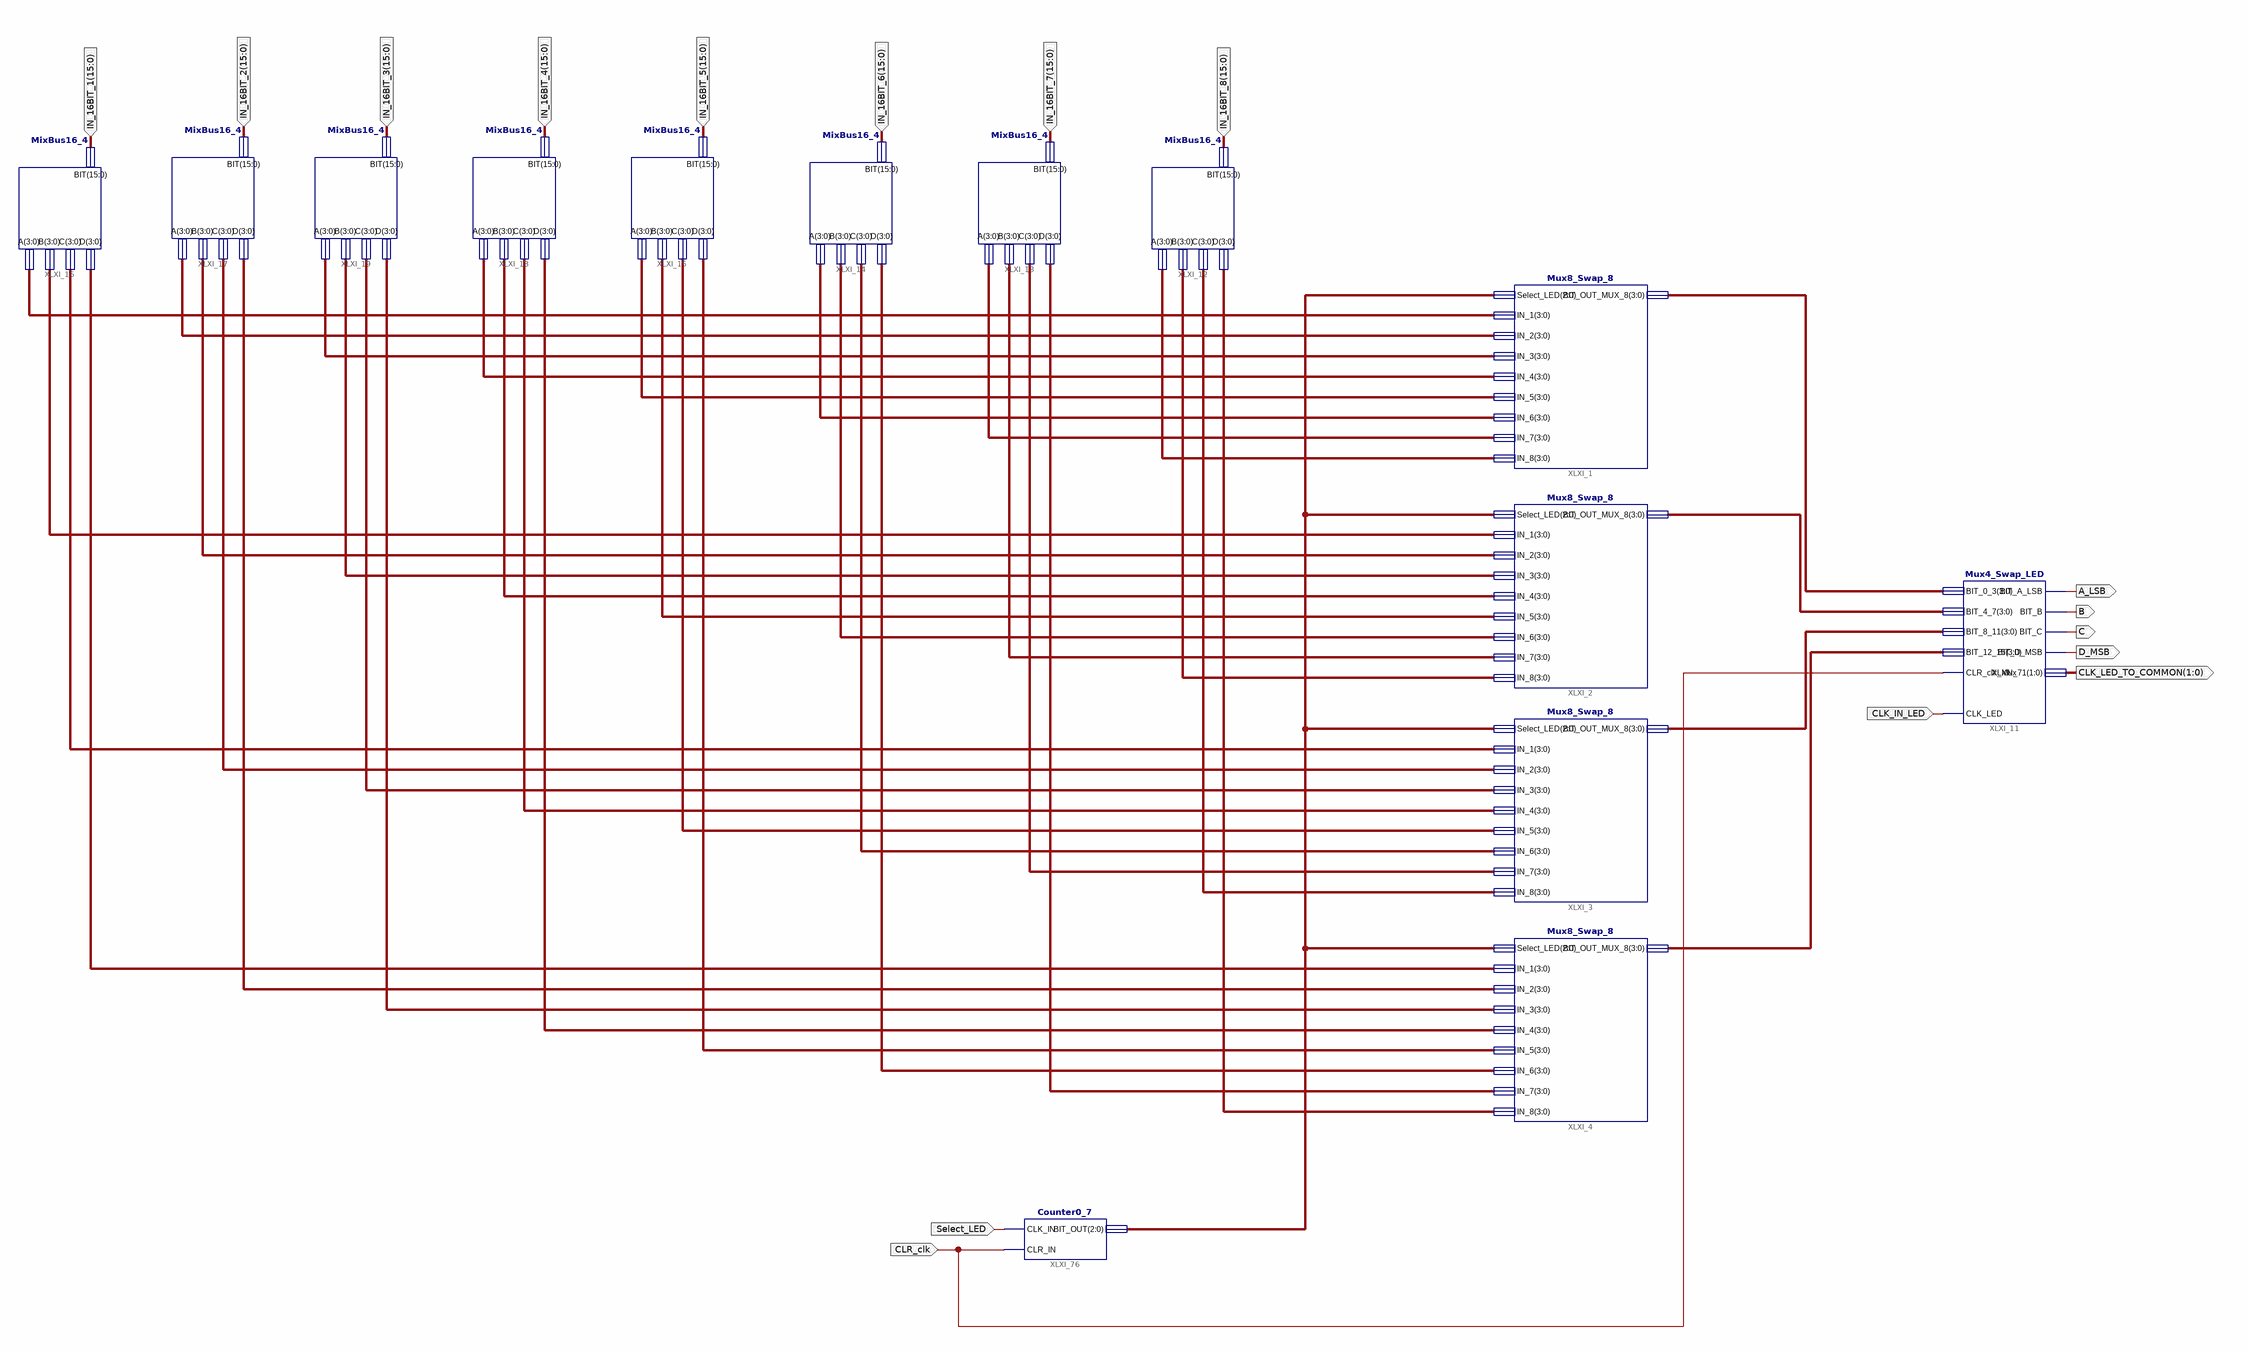
[diagram p0: schematic sheet 1]
// Xilinx ISE schematic Mux_8_Swap_1.sch (spartan6) as structural Verilog: 14 symbols, 16 ports
module Mux_8_Swap_1 (
  input  [15:0] IN_16BIT_1,
  input  [15:0] IN_16BIT_2,
  input  [15:0] IN_16BIT_3,
  input  [15:0] IN_16BIT_4,
  input  [15:0] IN_16BIT_5,
  input  [15:0] IN_16BIT_6,
  input  [15:0] IN_16BIT_7,
  input  [15:0] IN_16BIT_8,
  input  CLR_clk,
  input  Select_LED,
  input  CLK_IN_LED,
  output A_LSB,
  output B,
  output C,
  output D_MSB,
  output [1:0] CLK_LED_TO_COMMON
);

  wire [2:0] XLXN_8;
  wire [3:0] XLXN_1, XLXN_2, XLXN_3, XLXN_4, XLXN_67, XLXN_68, XLXN_69, XLXN_70, XLXN_71, XLXN_72, XLXN_73,
       XLXN_74, XLXN_75, XLXN_76, XLXN_78, XLXN_79, XLXN_80, XLXN_81, XLXN_82, XLXN_83, XLXN_84, XLXN_85,
       XLXN_86, XLXN_87, XLXN_88, XLXN_89, XLXN_90, XLXN_91, XLXN_92, XLXN_93, XLXN_94, XLXN_95, XLXN_96,
       XLXN_97, XLXN_98, XLXN_99;

  MixBus16_4 XLXI_12 (.BIT(IN_16BIT_8), .D(XLXN_99), .C(XLXN_92), .B(XLXN_85), .A(XLXN_78));
  MixBus16_4 XLXI_15 (.BIT(IN_16BIT_5), .D(XLXN_96), .C(XLXN_89), .B(XLXN_82), .A(XLXN_74));
  MixBus16_4 XLXI_14 (.BIT(IN_16BIT_6), .D(XLXN_97), .C(XLXN_90), .B(XLXN_83), .A(XLXN_75));
  MixBus16_4 XLXI_13 (.BIT(IN_16BIT_7), .D(XLXN_98), .C(XLXN_91), .B(XLXN_84), .A(XLXN_76));
  Mux4_Swap_LED XLXI_11 (
    .BIT_0_3(XLXN_1), .BIT_4_7(XLXN_2), .BIT_8_11(XLXN_3), .BIT_12_15(XLXN_4), .CLR_clk_Mux(CLR_clk),
    .BIT_A_LSB(A_LSB), .BIT_D_MSB(D_MSB), .BIT_C(C), .BIT_B(B), .XLXN_71(CLK_LED_TO_COMMON),
    .CLK_LED(CLK_IN_LED));
  Mux8_Swap_8 XLXI_4 (
    .Select_LED(XLXN_8), .IN_1(XLXN_70), .IN_2(XLXN_93), .IN_3(XLXN_94), .IN_4(XLXN_95), .IN_5(XLXN_96),
    .IN_6(XLXN_97), .IN_7(XLXN_98), .IN_8(XLXN_99), .BIT_OUT_MUX_8(XLXN_4));
  Mux8_Swap_8 XLXI_3 (
    .Select_LED(XLXN_8), .IN_1(XLXN_69), .IN_2(XLXN_86), .IN_3(XLXN_87), .IN_4(XLXN_88), .IN_5(XLXN_89),
    .IN_6(XLXN_90), .IN_7(XLXN_91), .IN_8(XLXN_92), .BIT_OUT_MUX_8(XLXN_3));
  Mux8_Swap_8 XLXI_2 (
    .Select_LED(XLXN_8), .IN_1(XLXN_68), .IN_2(XLXN_79), .IN_3(XLXN_80), .IN_4(XLXN_81), .IN_5(XLXN_82),
    .IN_6(XLXN_83), .IN_7(XLXN_84), .IN_8(XLXN_85), .BIT_OUT_MUX_8(XLXN_2));
  Mux8_Swap_8 XLXI_1 (
    .Select_LED(XLXN_8), .IN_1(XLXN_67), .IN_2(XLXN_71), .IN_3(XLXN_72), .IN_4(XLXN_73), .IN_5(XLXN_74),
    .IN_6(XLXN_75), .IN_7(XLXN_76), .IN_8(XLXN_78), .BIT_OUT_MUX_8(XLXN_1));
  MixBus16_4 XLXI_16 (.BIT(IN_16BIT_1), .D(XLXN_70), .C(XLXN_69), .B(XLXN_68), .A(XLXN_67));
  MixBus16_4 XLXI_17 (.BIT(IN_16BIT_2), .D(XLXN_93), .C(XLXN_86), .B(XLXN_79), .A(XLXN_71));
  MixBus16_4 XLXI_19 (.BIT(IN_16BIT_3), .D(XLXN_94), .C(XLXN_87), .B(XLXN_80), .A(XLXN_72));
  MixBus16_4 XLXI_18 (.BIT(IN_16BIT_4), .D(XLXN_95), .C(XLXN_88), .B(XLXN_81), .A(XLXN_73));
  Counter0_7 XLXI_76 (.CLK_IN(Select_LED), .CLR_IN(CLR_clk), .BIT_OUT(XLXN_8));
endmodule
